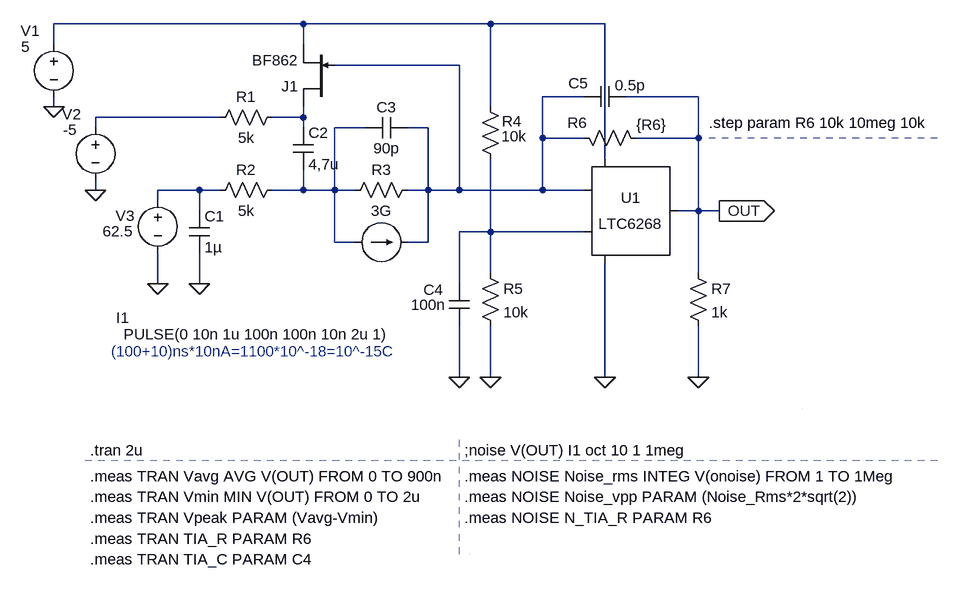
[diagram p0: schematic Gamma PIN LTC6268 TIA sim.asc]
Gamma PIN LTC6268 TIA sim.asc, the LTspice schematic file:
Version 4
SHEET 1 3188 1012
WIRE 208 -192 -176 -192
WIRE 496 -192 208 -192
WIRE 672 -192 496 -192
WIRE -176 -160 -176 -192
WIRE 208 -160 208 -192
WIRE 448 -128 256 -128
WIRE 640 -80 576 -80
WIRE 816 -80 704 -80
WIRE -176 -64 -176 -80
WIRE 496 -64 496 -192
WIRE 80 -48 -112 -48
WIRE 208 -48 208 -64
WIRE 208 -48 160 -48
WIRE -112 -32 -112 -48
WIRE 208 -32 208 -48
WIRE 304 -32 256 -32
WIRE 400 -32 368 -32
WIRE 576 -16 576 -80
WIRE 640 -16 576 -16
WIRE 816 -16 816 -80
WIRE 816 -16 720 -16
WIRE 672 16 672 -192
WIRE -112 64 -112 48
WIRE 48 64 -16 64
WIRE 80 64 48 64
WIRE 208 64 208 32
WIRE 208 64 160 64
WIRE 256 64 256 -32
WIRE 256 64 208 64
WIRE 288 64 256 64
WIRE 400 64 400 -32
WIRE 400 64 368 64
WIRE 448 64 448 -128
WIRE 448 64 400 64
WIRE 576 64 576 -16
WIRE 576 64 448 64
WIRE 640 64 576 64
WIRE -16 80 -16 64
WIRE 48 96 48 64
WIRE 816 96 816 -16
WIRE 816 96 784 96
WIRE 848 96 816 96
WIRE 496 128 496 16
WIRE 496 128 448 128
WIRE 640 128 496 128
WIRE 256 144 256 64
WIRE 288 144 256 144
WIRE 400 144 400 64
WIRE 400 144 368 144
WIRE 496 192 496 128
WIRE 816 192 816 96
WIRE -16 208 -16 160
WIRE 48 208 48 160
WIRE 448 208 448 128
WIRE 448 352 448 272
WIRE 496 352 496 272
WIRE 672 352 672 176
WIRE 816 352 816 272
FLAG 48 208 0
FLAG -16 208 0
FLAG 496 352 0
FLAG 672 352 0
FLAG -176 -64 0
FLAG 448 352 0
FLAG -112 64 0
FLAG 816 352 0
FLAG 848 96 OUT
IOPIN 848 96 Out
SYMBOL res 272 80 R270
WINDOW 3 0 56 VBottom 2
WINDOW 0 32 56 VTop 2
SYMATTR Value 3G
SYMATTR InstName R3
SYMATTR SpiceLine tol=1 pwr=0.1
SYMBOL cap 304 -16 R270
WINDOW 0 32 32 VTop 2
WINDOW 3 0 32 VBottom 2
SYMATTR InstName C3
SYMATTR Value 90p
SYMBOL cap 32 96 R0
SYMATTR InstName C1
SYMATTR Value 1µ
SYMATTR SpiceLine V=63 Irms=0 Rser=0.305 Lser=7.48655p
SYMBOL voltage -16 64 R0
WINDOW 123 0 0 Left 2
WINDOW 39 0 0 Left 2
WINDOW 0 -65 39 Left 2
WINDOW 3 -85 63 Left 2
SYMATTR InstName V3
SYMATTR Value 62.5
SYMBOL cap 640 -96 M90
WINDOW 0 11 -9 VBottom 2
WINDOW 3 -17 71 VTop 2
SYMATTR InstName C5
SYMATTR Value 0.5p
SYMBOL res 480 176 R0
SYMATTR InstName R5
SYMATTR Value 10k
SYMBOL voltage -176 -176 R0
WINDOW 0 -51 -5 Left 2
WINDOW 3 -50 19 Left 2
WINDOW 123 0 0 Left 2
WINDOW 39 0 0 Left 2
SYMATTR InstName V1
SYMATTR Value 5
SYMBOL current 288 144 R270
WINDOW 123 0 0 Left 2
WINDOW 39 24 28 Left 2
WINDOW 0 -116 -348 VLeft 2
WINDOW 3 -142 -151 VCenter 2
SYMATTR InstName I1
SYMATTR Value PULSE(0 10n 1u 100n 100n 10n 2u 1)
SYMBOL cap 432 208 R0
WINDOW 0 -39 9 Left 2
WINDOW 3 -58 32 Left 2
SYMATTR InstName C4
SYMATTR Value 100n
SYMATTR SpiceLine V=63 Irms=0 Rser=0.305 Lser=7.48655p
SYMBOL res 480 -80 R0
WINDOW 0 34 38 Left 2
WINDOW 3 33 61 Left 2
SYMATTR InstName R4
SYMATTR Value 10k
SYMBOL res 736 0 M270
WINDOW 0 24 106 VTop 2
WINDOW 3 52 -8 VBottom 2
SYMATTR InstName R6
SYMATTR Value {R6}
SYMBOL res 64 80 R270
WINDOW 3 0 56 VBottom 2
WINDOW 0 32 56 VTop 2
SYMATTR Value 5k
SYMATTR InstName R2
SYMATTR SpiceLine tol=1 pwr=0.1
SYMBOL cap 192 -32 R0
SYMATTR InstName C2
SYMATTR Value 4,7u
SYMBOL res 64 -32 R270
WINDOW 3 0 56 VBottom 2
WINDOW 0 32 56 VTop 2
SYMATTR Value 5k
SYMATTR InstName R1
SYMATTR SpiceLine tol=1 pwr=0.1
SYMBOL voltage -112 -48 R0
WINDOW 0 -51 -5 Left 2
WINDOW 3 -50 19 Left 2
WINDOW 123 0 0 Left 2
WINDOW 39 0 0 Left 2
SYMATTR InstName V2
SYMATTR Value -5
SYMBOL Opamps\\LTC6268 672 96 R0
SYMATTR InstName U1
SYMBOL res 800 176 R0
SYMATTR InstName R7
SYMATTR Value 1k
SYMBOL njf 256 -64 R180
SYMATTR InstName J1
SYMATTR Value BF862
TEXT -120 464 Left 2 !.tran 2u
TEXT -88 312 Left 2 ;(100+10)ns*10nA=1100*10^-18=10^-15C
TEXT 456 464 Left 2 !;noise V(OUT) I1 oct 10 1 1meg
TEXT 832 -40 Left 2 !.step param R6 10k 10meg 10k
TEXT -120 536 Left 2 !.meas TRAN Vmin MIN V(OUT) FROM 0 TO 2u
TEXT 456 504 Left 2 !.meas NOISE Noise_rms INTEG V(onoise) FROM 1 TO 1Meg
TEXT -120 504 Left 2 !.meas TRAN Vavg AVG V(OUT) FROM 0 TO 900n
TEXT -120 568 Left 2 !.meas TRAN Vpeak PARAM (Vavg-Vmin)
TEXT 456 536 Left 2 !.meas NOISE Noise_vpp PARAM (Noise_Rms*2*sqrt(2))
TEXT -120 600 Left 2 !.meas TRAN TIA_R PARAM R6
TEXT 456 568 Left 2 !.meas NOISE N_TIA_R PARAM R6
TEXT -120 632 Left 2 !.meas TRAN TIA_C PARAM C4
LINE Normal 976 400 976 400 2
LINE Normal 1184 480 -128 480 1
LINE Normal 1184 480 1184 480 1
LINE Normal 448 624 448 448 1
LINE Normal 464 624 464 624 1
LINE Normal 1184 -16 832 -16 1
LINE Normal 1184 -16 1184 -16 1

The netlist it stands for:
* Gamma PIN LTC6268 TIA sim.asc
R3 N005 N002 3G tol=1 pwr=0.1
C3 N005 N002 90p
C1 N006 0 1µ V=63 Irms=0 Rser=0.305 Lser=7.48655p
V3 N006 0 62.5
C5 N002 OUT 0.5p
R5 N007 0 10k
V1 N001 0 5
I1 N005 N002 PULSE(0 10n 1u 100n 100n 10n 2u 1)
C4 N007 0 100n V=63 Irms=0 Rser=0.305 Lser=7.48655p
R4 N001 N007 10k
R6 OUT N002 {R6}
R2 N006 N005 5k tol=1 pwr=0.1
C2 N004 N005 4,7u
R1 N003 N004 5k tol=1 pwr=0.1
V2 N003 0 -5
XU1 N007 N002 OUT N001 0 NC_01 LTC6268
R7 OUT 0 1k
J1 N004 N002 N001 BF862
.model NJF NJF
.model PJF PJF
.lib standard.jft
.tran 2u
* (100+10)ns*10nA=1100*10^-18=10^-15C
;noise V(OUT) I1 oct 10 1 1meg
.step param R6 10k 10meg 10k
.meas TRAN Vmin MIN V(OUT) FROM 0 TO 2u
.meas NOISE Noise_rms INTEG V(onoise) FROM 1 TO 1Meg
.meas TRAN Vavg AVG V(OUT) FROM 0 TO 900n
.meas TRAN Vpeak PARAM (Vavg-Vmin)
.meas NOISE Noise_vpp PARAM (Noise_Rms*2*sqrt(2))
.meas TRAN TIA_R PARAM R6
.meas NOISE N_TIA_R PARAM R6
.meas TRAN TIA_C PARAM C4
.lib LTC2.lib
.backanno
.end